# Altium schematic sheet J1-3xGTHQ_R+B66.SchDoc
size A4; CompanyName: Technische Hochschule Nürnberg Georg Simon Ohm; Organization: UltraZohm; Address1: Kesslerplatz 12; Address2: 90489 Nürnberg; Address3: GERMANY; SheetNumber: 3; Website: www.ultrazohm.com
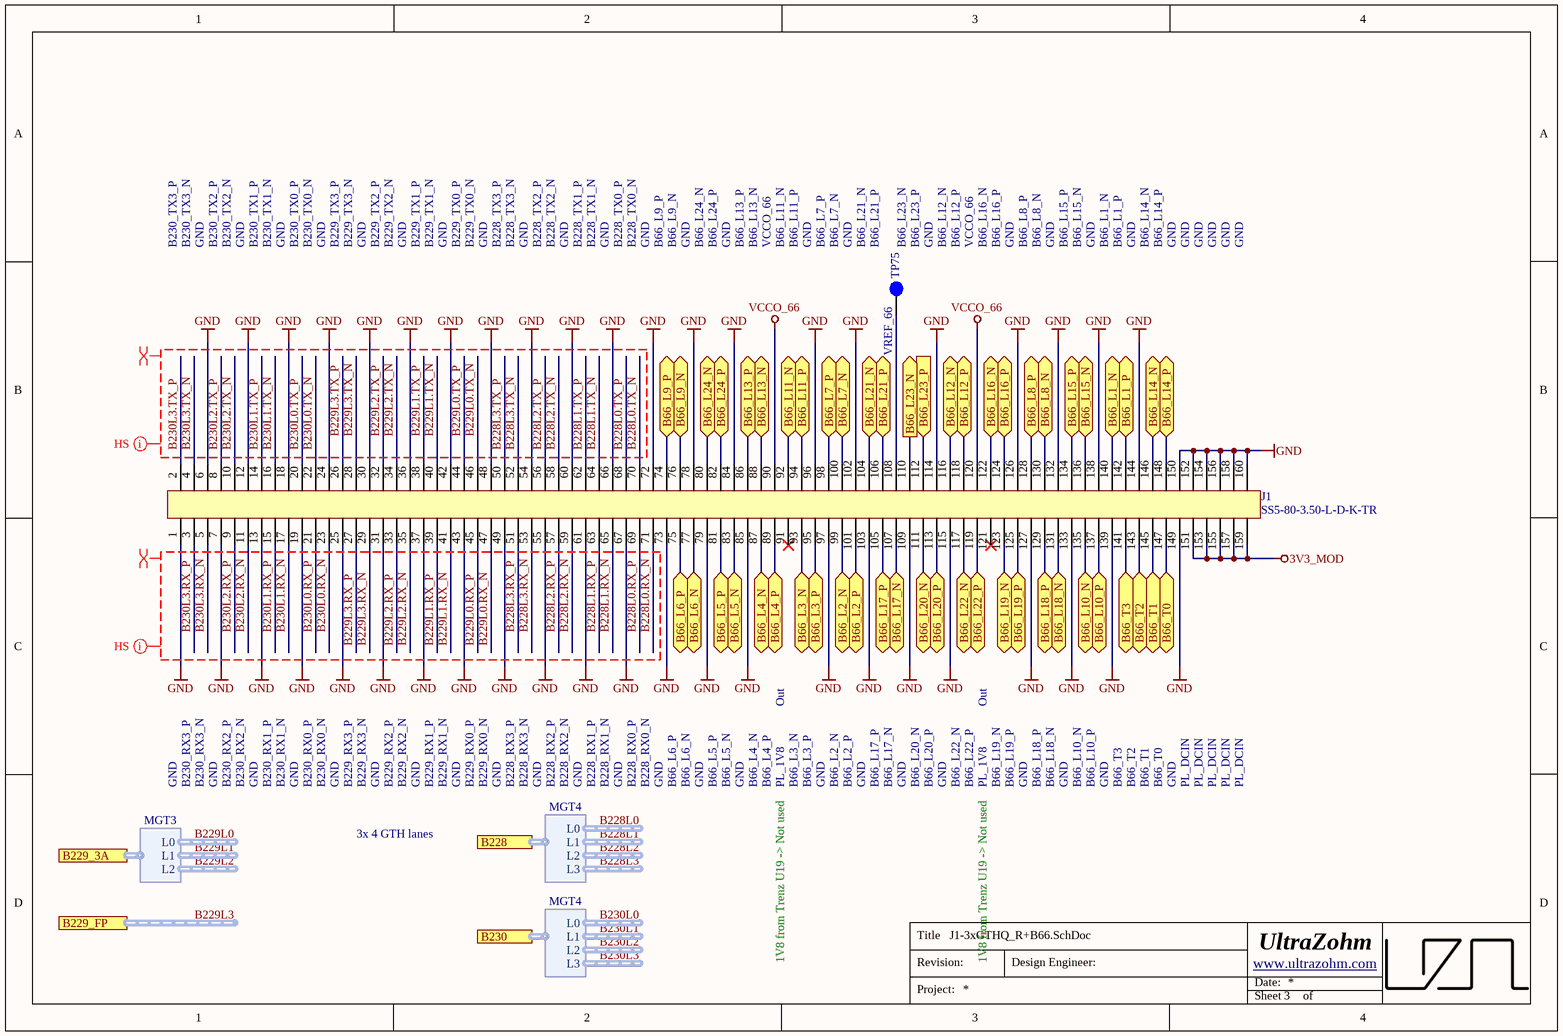
[diagram p0: J1-3xGTHQ_R+B66.SchDoc]

## Parts
J1  SS5-80-3.50-L-D-K-TR  [SS5-80-3.50-L-D-K-TR]
TP75  Testpoint 1mm  [TP_1mm]  (value not drawn)  (no BOM)

## Ports
B66_L1_N (bidir), B66_L1_P (bidir), B66_L2_N (bidir), B66_L2_P (bidir), B66_L3_N (bidir), B66_L3_P (bidir), B66_L4_N (bidir), B66_L4_P (bidir), B66_L5_N (bidir), B66_L5_P (bidir), B66_L6_N (bidir), B66_L6_P (bidir), B66_L7_N (bidir), B66_L7_P (bidir), B66_L8_N (bidir), B66_L8_P (bidir), B66_L9_N (bidir), B66_L9_P (bidir), B66_L10_N (bidir), B66_L10_P (bidir), B66_L11_N (bidir), B66_L11_P (bidir), B66_L12_N (bidir), B66_L12_P (bidir), B66_L13_N (bidir), B66_L13_P (bidir), B66_L14_N (bidir), B66_L14_P (bidir), B66_L15_N (bidir), B66_L15_P (bidir), B66_L16_N (bidir), B66_L16_P (bidir), B66_L17_N (bidir), B66_L17_P (bidir), B66_L18_N (bidir), B66_L18_P (bidir), B66_L19_N (bidir), B66_L19_P (bidir), B66_L20_N (bidir), B66_L20_P (bidir), B66_L21_N (bidir), B66_L21_P (bidir), B66_L22_N (bidir), B66_L22_P (bidir), B66_L23_N (out), B66_L23_P (in), B66_L24_N (bidir), B66_L24_P (bidir), B66_T0 (bidir), B66_T1 (bidir), B66_T2 (bidir), B66_T3 (bidir), B228 (harness MGT4), B229_3A (harness MGT3), B229_FP (harness GTH), B230 (harness MGT4)

## Harnesses
MGT3: L0, L1, L2
MGT4: L0, L1, L2, L3

## Nets
3V3_MOD: J1.151 J1.153 J1.155 J1.157 J1.159
GND: J1.1 J1.6 J1.7 J1.12 J1.13 J1.18 J1.19 J1.24 J1.25 J1.30 J1.31 J1.36 J1.37 J1.42 J1.43 J1.48 J1.49 J1.54 J1.55 J1.60 J1.61 J1.66 J1.67 J1.72 J1.73 J1.78 J1.79 J1.84 J1.85 J1.96 J1.97 J1.102 J1.103 J1.109 J1.114 J1.115 J1.126 J1.127 J1.132 J1.133 J1.138 J1.139 J1.144 J1.149 J1.150 J1.152 J1.154 J1.156 J1.158 J1.160
VCCO_66: J1.90 J1.120
B66_L1_N: J1.140 ; port B66_L1_N
B66_L1_P: J1.142 ; port B66_L1_P
B66_L2_N: J1.99 ; port B66_L2_N
B66_L2_P: J1.101 ; port B66_L2_P
B66_L3_N: J1.93 ; port B66_L3_N
B66_L3_P: J1.95 ; port B66_L3_P
B66_L4_N: J1.87 ; port B66_L4_N
B66_L4_P: J1.89 ; port B66_L4_P
B66_L5_N: J1.83 ; port B66_L5_N
B66_L5_P: J1.81 ; port B66_L5_P
B66_L6_N: J1.77 ; port B66_L6_N
B66_L6_P: J1.75 ; port B66_L6_P
B66_L7_N: J1.100 ; port B66_L7_N
B66_L7_P: J1.98 ; port B66_L7_P
B66_L8_N: J1.130 ; port B66_L8_N
B66_L8_P: J1.128 ; port B66_L8_P
B66_L9_N: J1.76 ; port B66_L9_N
B66_L9_P: J1.74 ; port B66_L9_P
B66_L10_N: J1.135 ; port B66_L10_N
B66_L10_P: J1.137 ; port B66_L10_P
B66_L11_N: J1.92 ; port B66_L11_N
B66_L11_P: J1.94 ; port B66_L11_P
B66_L12_N: J1.116 ; port B66_L12_N
B66_L12_P: J1.118 ; port B66_L12_P
B66_L13_N: J1.88 ; port B66_L13_N
B66_L13_P: J1.86 ; port B66_L13_P
B66_L14_N: J1.146 ; port B66_L14_N
B66_L14_P: J1.148 ; port B66_L14_P
B66_L15_N: J1.136 ; port B66_L15_N
B66_L15_P: J1.134 ; port B66_L15_P
B66_L16_N: J1.122 ; port B66_L16_N
B66_L16_P: J1.124 ; port B66_L16_P
B66_L17_N: J1.107 ; port B66_L17_N
B66_L17_P: J1.105 ; port B66_L17_P
B66_L18_N: J1.131 ; port B66_L18_N
B66_L18_P: J1.129 ; port B66_L18_P
B66_L19_N: J1.123 ; port B66_L19_N
B66_L19_P: J1.125 ; port B66_L19_P
B66_L20_N: J1.111 ; port B66_L20_N
B66_L20_P: J1.113 ; port B66_L20_P
B66_L21_N: J1.104 ; port B66_L21_N
B66_L21_P: J1.106 ; port B66_L21_P
B66_L22_N: J1.117 ; port B66_L22_N
B66_L22_P: J1.119 ; port B66_L22_P
B66_L23_N: J1.110 ; port B66_L23_N
B66_L23_P: J1.112 ; port B66_L23_P
B66_L24_N: J1.80 ; port B66_L24_N
B66_L24_P: J1.82 ; port B66_L24_P
B66_T0: J1.147 ; port B66_T0
B66_T1: J1.145 ; port B66_T1
B66_T2: J1.143 ; port B66_T2
B66_T3: J1.141 ; port B66_T3
B228L0.RX_N: J1.71
B228L0.RX_P: J1.69
B228L0.TX_N: J1.70
B228L0.TX_P: J1.68
B228L1.RX_N: J1.65
B228L1.RX_P: J1.63
B228L1.TX_N: J1.64
B228L1.TX_P: J1.62
B228L2.RX_N: J1.59
B228L2.RX_P: J1.57
B228L2.TX_N: J1.58
B228L2.TX_P: J1.56
B228L3.RX_N: J1.53
B228L3.RX_P: J1.51
B228L3.TX_N: J1.52
B228L3.TX_P: J1.50
B229L0.RX_N: J1.47
B229L0.RX_P: J1.45
B229L0.TX_N: J1.46
B229L0.TX_P: J1.44
B229L1.RX_N: J1.41
B229L1.RX_P: J1.39
B229L1.TX_N: J1.40
B229L1.TX_P: J1.38
B229L2.RX_N: J1.35
B229L2.RX_P: J1.33
B229L2.TX_N: J1.34
B229L2.TX_P: J1.32
B229L3.RX_N: J1.29
B229L3.RX_P: J1.27
B229L3.TX_N: J1.28
B229L3.TX_P: J1.26
B230L0.RX_N: J1.23
B230L0.RX_P: J1.21
B230L0.TX_N: J1.22
B230L0.TX_P: J1.20
B230L1.RX_N: J1.17
B230L1.RX_P: J1.15
B230L1.TX_N: J1.16
B230L1.TX_P: J1.14
B230L2.RX_N: J1.11
B230L2.RX_P: J1.9
B230L2.TX_N: J1.10
B230L2.TX_P: J1.8
B230L3.RX_N: J1.5
B230L3.RX_P: J1.3
B230L3.TX_N: J1.4
B230L3.TX_P: J1.2
NetJ1_108: J1.108 TP75.1

Not connected (* = marked no-connect by the designer): J1 91* 121*

## Buses and harness runs
harness B229L3 = port B229_FP

## Layout directives
differential pair: B228L0.RX_N, B228L0.RX_P, B228L0.TX_N, B228L0.TX_P, B228L1.RX_N, B228L1.RX_P, B228L1.TX_N, B228L1.TX_P, B228L2.RX_N, B228L2.RX_P, B228L2.TX_N, B228L2.TX_P, B228L3.RX_N, B228L3.RX_P, B228L3.TX_N, B228L3.TX_P, B229L0.RX_N, B229L0.RX_P, B229L0.TX_N, B229L0.TX_P, B229L1.RX_N, B229L1.RX_P, B229L1.TX_N, B229L1.TX_P, B229L2.RX_N, B229L2.RX_P, B229L2.TX_N, B229L2.TX_P, B229L3.RX_N, B229L3.RX_P, B229L3.TX_N, B229L3.TX_P, B230L0.RX_N, B230L0.RX_P, B230L0.TX_N, B230L0.TX_P, B230L1.RX_N, B230L1.RX_P, B230L1.TX_N, B230L1.TX_P, B230L2.RX_N, B230L2.RX_P, B230L2.TX_N, B230L2.TX_P, B230L3.RX_N, B230L3.RX_P, B230L3.TX_N, B230L3.TX_P
net class HS: B228L0.RX_N, B228L0.RX_P, B228L0.TX_N, B228L0.TX_P, B228L1.RX_N, B228L1.RX_P, B228L1.TX_N, B228L1.TX_P, B228L2.RX_N, B228L2.RX_P, B228L2.TX_N, B228L2.TX_P, B228L3.RX_N, B228L3.RX_P, B228L3.TX_N, B228L3.TX_P, B229L0.RX_N, B229L0.RX_P, B229L0.TX_N, B229L0.TX_P, B229L1.RX_N, B229L1.RX_P, B229L1.TX_N, B229L1.TX_P, B229L2.RX_N, B229L2.RX_P, B229L2.TX_N, B229L2.TX_P, B229L3.RX_N, B229L3.RX_P, B229L3.TX_N, B229L3.TX_P, B230L0.RX_N, B230L0.RX_P, B230L0.TX_N, B230L0.TX_P, B230L1.RX_N, B230L1.RX_P, B230L1.TX_N, B230L1.TX_P, B230L2.RX_N, B230L2.RX_P, B230L2.TX_N, B230L2.TX_P, B230L3.RX_N, B230L3.RX_P, B230L3.TX_N, B230L3.TX_P

## Notes on the sheet
- B230_TX3_P
- B230_TX3_N
- GND
- B230_TX2_P
- B230_TX2_N
- B230_TX1_P
- B230_TX1_N
- B230_TX0_P
- B230_TX0_N
- B229_TX3_P
- B229_TX3_N
- B229_TX2_P
- B229_TX2_N
- B229_TX1_P
- B229_TX1_N
- B229_TX0_P
- B229_TX0_N
- B228_TX3_P
- B228_TX3_N
- B228_TX2_P
- B228_TX2_N
- B228_TX1_P
- B228_TX1_N
- B228_TX0_P
- B228_TX0_N
- B66_L9_P
- B66_L9_N
- B66_L24_N
- B66_L24_P
- B66_L13_P
- B66_L13_N
- VCCO_66
- B66_L11_N
- B66_L11_P
- B66_L7_P
- B66_L7_N
- (near TP75) B66_L21_N
- (near TP75) B66_L21_P
- (near TP75) B66_L23_N
- (near TP75) B66_L23_P
- (near TP75) GND
- B66_L12_N
- B66_L12_P
- B66_L16_N
- B66_L16_P
- B66_L8_P
- B66_L8_N
- B66_L15_P
- B66_L15_N
- B66_L1_N
- B66_L1_P
- B66_L14_N
- B66_L14_P
- (near TP75) VREF_66
- Out
- B230_RX3_P
- B230_RX3_N
- B230_RX2_P
- B230_RX2_N
- B230_RX1_P
- B230_RX1_N
- B230_RX0_P
- B230_RX0_N
- B229_RX3_P
- B229_RX3_N
- B229_RX2_P
- B229_RX2_N
- B229_RX1_P
- B229_RX1_N
- B229_RX0_P
- B229_RX0_N
- B228_RX3_P
- B228_RX3_N
- B228_RX2_P
- B228_RX2_N
- B228_RX1_P
- B228_RX1_N
- B228_RX0_P
- B228_RX0_N
- B66_L6_P
- B66_L6_N
- B66_L5_P
- B66_L5_N
- B66_L4_N
- B66_L4_P
- PL_1V8
- B66_L3_N
- B66_L3_P
- B66_L2_N
- B66_L2_P
- B66_L17_P
- B66_L17_N
- B66_L20_N
- B66_L20_P
- B66_L22_N
- B66_L22_P
- B66_L19_N
- B66_L19_P
- B66_L18_P
- B66_L18_N
- B66_L10_N
- B66_L10_P
- B66_T3
- B66_T2
- B66_T1
- B66_T0
- PL_DCIN
- 3x 4 GTH lanes
- 1V8 from Trenz U19 -> Not used
- Title
- Revision:
- Design Engineer:
- Date:
- Project:
- Sheet
- of

## Library data of the parts
J1 = SS5-80-3.50-L-D-K-TR: 0.5 mm Ultra Fine Pitch Socket REF192552-01, 160 Pins; Manufacturer: SAMTEC; Created from: MGremer; Number of positions: 80; Manufacturer Part Number: SS5-80-3.50-L-D-K-TR; PartID: 27; Created On: 01/12/2020 18:14:32; ComponentLink1Description: Homepage; ComponentLink1URL: https://www.samtec.com/de/products/ss5-80-3.50-l-d-k-tr; Component Type: Samtec Connector; Device Package: Connector; Last Updated: 11/07/2024 09:43:54; Mounting Type: SMD; Supplier 1: SAMTEC; Supplier Part Number 1: SS5-80-3.50-L-D-K-TR; Type: Connector; Live Cycle Status: 1; Number of rows: 2; Stock number: not stored; LCSC Part Number: C5292077
TP75 = 25063: AN: 25063; Mixed: SMT